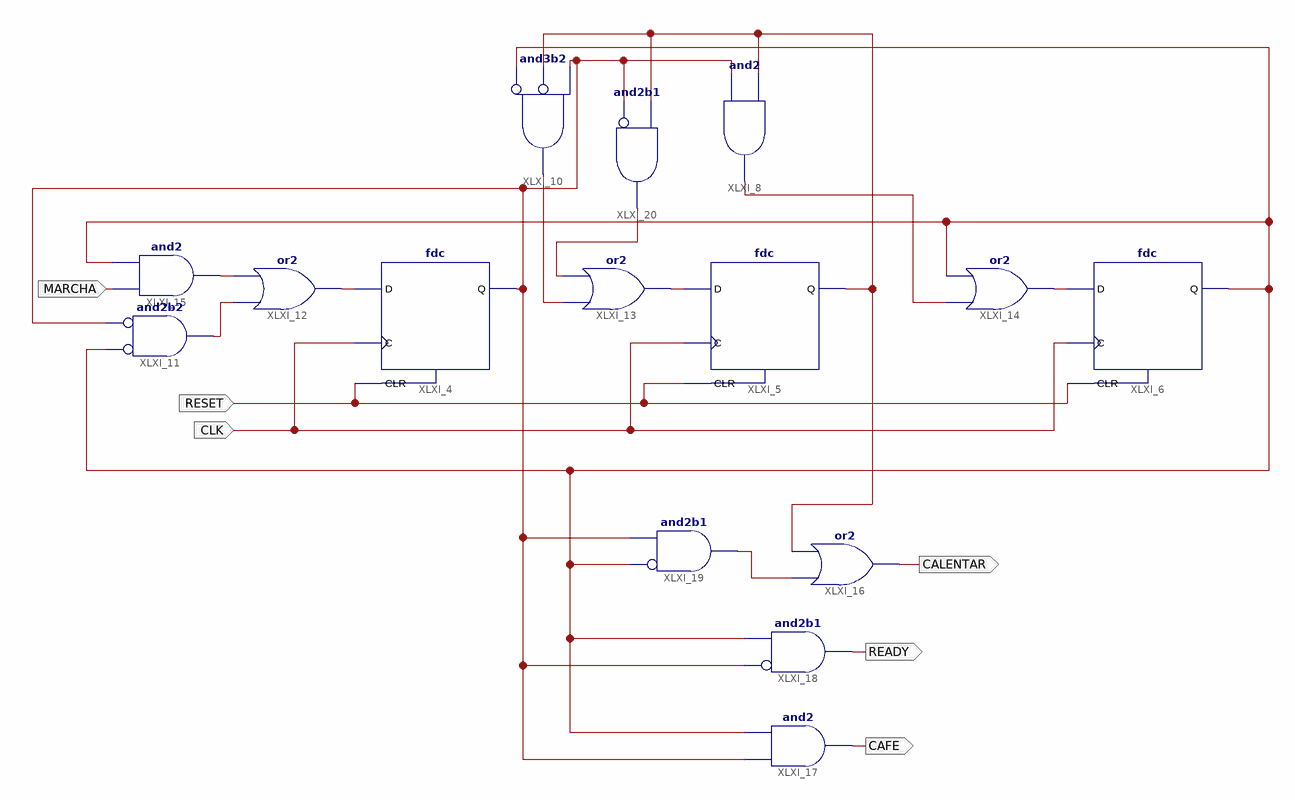
[diagram p0: schematic sheet 1]
// Xilinx ISE schematic p4ej1.sch (spartan3) as structural Verilog: 15 symbols, 6 ports
module p4ej1 (
  input  RESET,
  input  CLK,
  input  MARCHA,
  output CALENTAR,
  output READY,
  output CAFE
);

  wire XLXN_10, XLXN_12, XLXN_13, XLXN_17, XLXN_26, XLXN_29, XLXN_31, XLXN_32, XLXN_35, XLXN_46, XLXN_47,
       XLXN_54;

  fdc XLXI_4 (.C(CLK), .CLR(RESET), .D(XLXN_10), .Q(XLXN_17));
  fdc XLXI_5 (.C(CLK), .CLR(RESET), .D(XLXN_26), .Q(XLXN_31));
  fdc XLXI_6 (.C(CLK), .CLR(RESET), .D(XLXN_32), .Q(XLXN_35));
  and XLXI_8 (XLXN_46, XLXN_17, XLXN_31);
  and XLXI_10 (XLXN_29, ~XLXN_35, ~XLXN_31, XLXN_17);  // and3b2
  and XLXI_11 (XLXN_13, ~XLXN_35, ~XLXN_17);  // and2b2
  or XLXI_12 (XLXN_10, XLXN_13, XLXN_12);
  or XLXI_13 (XLXN_26, XLXN_29, XLXN_47);
  or XLXI_14 (XLXN_32, XLXN_46, XLXN_35);
  and XLXI_15 (XLXN_12, MARCHA, XLXN_35);
  or XLXI_16 (CALENTAR, XLXN_54, XLXN_31);
  and XLXI_17 (CAFE, XLXN_17, XLXN_35);
  and XLXI_18 (READY, ~XLXN_17, XLXN_35);  // and2b1
  and XLXI_19 (XLXN_54, ~XLXN_35, XLXN_17);  // and2b1
  and XLXI_20 (XLXN_47, ~XLXN_17, XLXN_31);  // and2b1
endmodule
